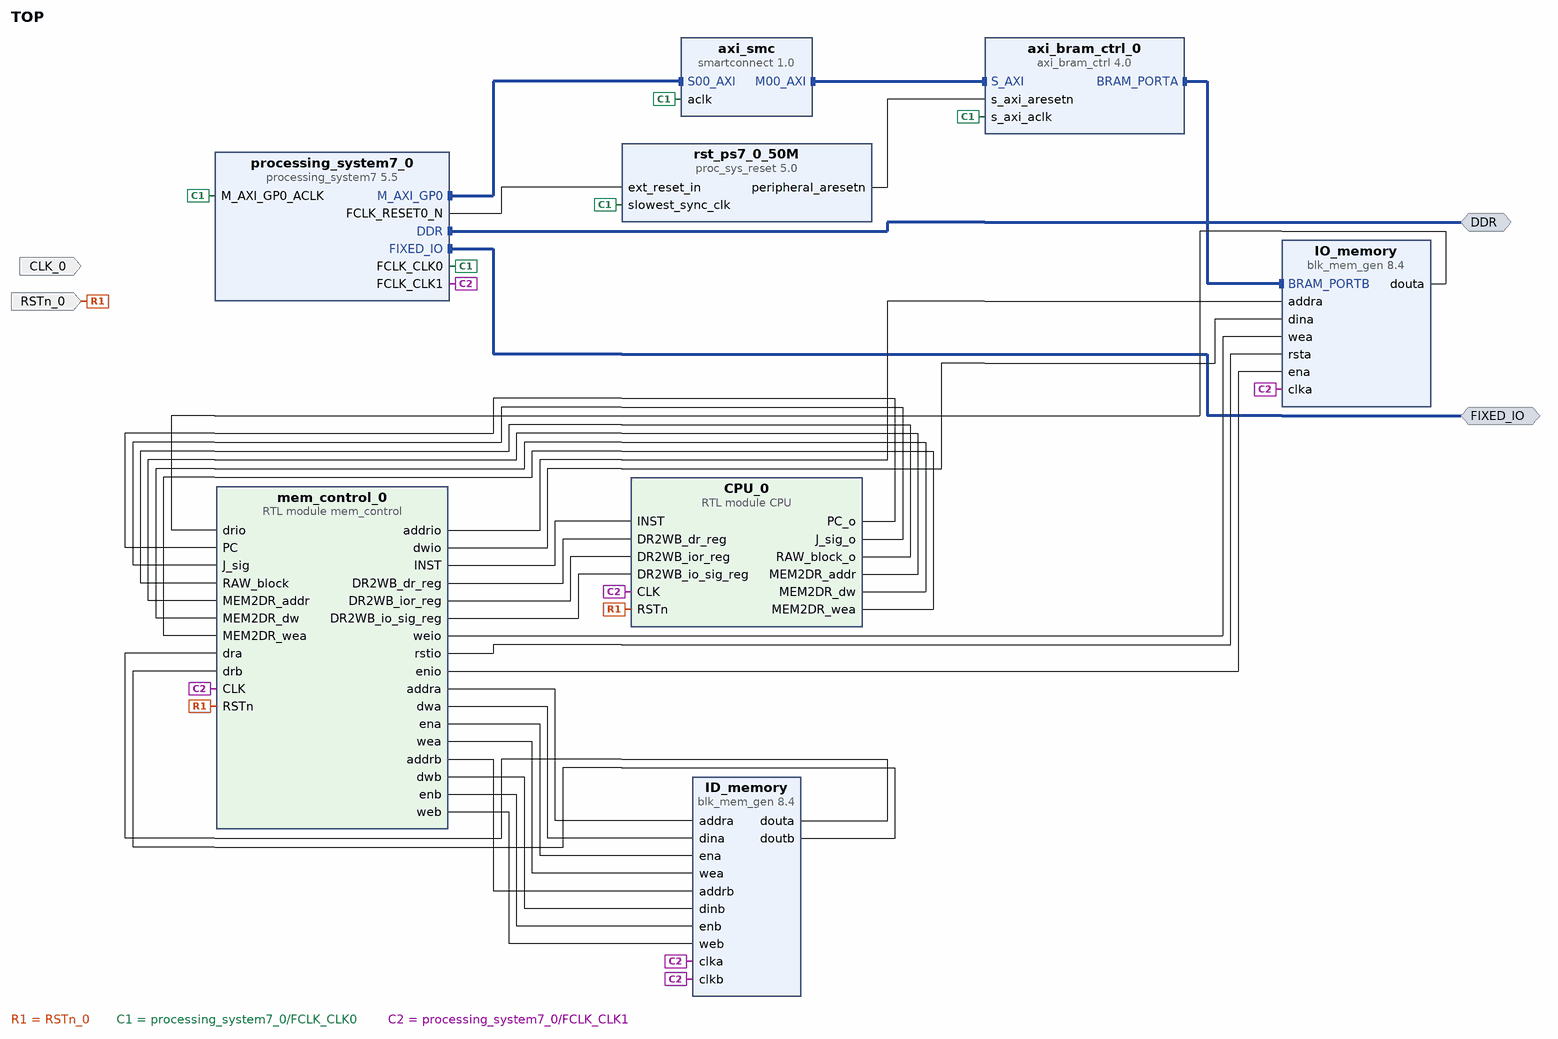
[diagram p0: block diagram of the top level]
# Vivado block design TOP, xc7z020clg400-2, Vivado 2017.4
create_bd_design TOP

create_bd_intf_port -mode Master -vlnv xilinx.com:interface:ddrx_rtl:1.0 DDR
create_bd_intf_port -mode Master -vlnv xilinx.com:display_processing_system7:fixedio_rtl:1.0 FIXED_IO
create_bd_port -dir I -type clk CLK_0
set_property -dict {CONFIG.FREQ_HZ 1000000} [get_bd_ports CLK_0]
create_bd_port -dir I -type rst RSTn_0

create_bd_cell -type ip -vlnv xilinx.com:ip:blk_mem_gen:8.4 IO_memory
set_property -dict [list \
  CONFIG.Memory_Type True_Dual_Port_RAM \
  CONFIG.Enable_B Use_ENB_Pin \
  CONFIG.Use_RSTB_Pin true \
  CONFIG.Port_B_Clock 100 \
  CONFIG.Port_B_Write_Rate 50 \
  CONFIG.Port_B_Enable_Rate 100 \
  CONFIG.EN_SAFETY_CKT false \
] [get_bd_cells IO_memory]
create_bd_cell -type ip -vlnv xilinx.com:ip:axi_bram_ctrl:4.0 axi_bram_ctrl_0
set_property -dict {CONFIG.SINGLE_PORT_BRAM 1} [get_bd_cells axi_bram_ctrl_0]
create_bd_cell -type ip -vlnv xilinx.com:ip:processing_system7:5.5 processing_system7_0
set_property -dict [list \
  CONFIG.PCW_FCLK_CLK1_BUF TRUE \
  CONFIG.PCW_SDIO_PERIPHERAL_FREQMHZ 100 \
  CONFIG.PCW_UART_PERIPHERAL_FREQMHZ 100 \
  CONFIG.PCW_FPGA1_PERIPHERAL_FREQMHZ 1 \
  CONFIG.PCW_EN_CLK1_PORT 1 \
  CONFIG.PCW_PRESET_BANK1_VOLTAGE {LVCMOS 1.8V} \
  CONFIG.PCW_UIPARAM_DDR_PARTNO {MT41J256M16 RE-125} \
  CONFIG.PCW_QSPI_PERIPHERAL_ENABLE 1 \
  CONFIG.PCW_QSPI_QSPI_IO {MIO 1 .. 6} \
  CONFIG.PCW_QSPI_GRP_SINGLE_SS_ENABLE 1 \
  CONFIG.PCW_QSPI_GRP_SINGLE_SS_IO {MIO 1 .. 6} \
  CONFIG.PCW_SINGLE_QSPI_DATA_MODE x4 \
  CONFIG.PCW_QSPI_GRP_FBCLK_ENABLE 1 \
  CONFIG.PCW_QSPI_GRP_FBCLK_IO {MIO 8} \
  CONFIG.PCW_ENET0_PERIPHERAL_ENABLE 1 \
  CONFIG.PCW_ENET0_ENET0_IO {MIO 16 .. 27} \
  CONFIG.PCW_ENET0_GRP_MDIO_ENABLE 1 \
  CONFIG.PCW_ENET0_GRP_MDIO_IO {MIO 52 .. 53} \
  CONFIG.PCW_ENET_RESET_ENABLE 1 \
  CONFIG.PCW_ENET_RESET_SELECT {Share reset pin} \
  CONFIG.PCW_ENET0_RESET_ENABLE 0 \
  CONFIG.PCW_SD0_PERIPHERAL_ENABLE 1 \
  CONFIG.PCW_SD0_SD0_IO {MIO 40 .. 45} \
  CONFIG.PCW_SD0_GRP_CD_ENABLE 1 \
  CONFIG.PCW_SD0_GRP_CD_IO {MIO 47} \
  CONFIG.PCW_SD0_GRP_WP_ENABLE 0 \
  CONFIG.PCW_UART1_PERIPHERAL_ENABLE 1 \
  CONFIG.PCW_UART1_UART1_IO {MIO 48 .. 49} \
  CONFIG.PCW_USB0_PERIPHERAL_ENABLE 1 \
  CONFIG.PCW_USB0_USB0_IO {MIO 28 .. 39} \
  CONFIG.PCW_USB_RESET_ENABLE 1 \
  CONFIG.PCW_USB_RESET_SELECT {Share reset pin} \
  CONFIG.PCW_USB0_RESET_ENABLE 1 \
  CONFIG.PCW_USB0_RESET_IO {MIO 46} \
  CONFIG.PCW_I2C_RESET_ENABLE 1 \
  CONFIG.PCW_GPIO_MIO_GPIO_ENABLE 1 \
  CONFIG.PCW_GPIO_MIO_GPIO_IO MIO \
  CONFIG.PCW_FPGA_FCLK1_ENABLE 1 \
] [get_bd_cells processing_system7_0]
# 204 more settings of processing_system7_0 are not shown: defaults, MIO pin electricals, DDR timing, and values the tool derives
create_bd_cell -type ip -vlnv xilinx.com:ip:proc_sys_reset:5.0 rst_ps7_0_50M
create_bd_cell -type ip -vlnv xilinx.com:ip:smartconnect:1.0 axi_smc
set_property -dict {CONFIG.NUM_SI 1} [get_bd_cells axi_smc]
create_bd_cell -type ip -vlnv xilinx.com:ip:blk_mem_gen:8.4 ID_memory
set_property -dict [list \
  CONFIG.Memory_Type True_Dual_Port_RAM \
  CONFIG.Enable_32bit_Address true \
  CONFIG.Write_Depth_A 65536 \
  CONFIG.Enable_B Use_ENB_Pin \
  CONFIG.Register_PortA_Output_of_Memory_Primitives false \
  CONFIG.Register_PortB_Output_of_Memory_Primitives false \
  CONFIG.Load_Init_File true \
  CONFIG.Coe_File d:/a.coe \
  CONFIG.Fill_Remaining_Memory_Locations false \
  CONFIG.Use_RSTA_Pin false \
  CONFIG.Use_RSTB_Pin false \
  CONFIG.Port_B_Clock 100 \
  CONFIG.Port_B_Write_Rate 50 \
  CONFIG.Port_B_Enable_Rate 100 \
  CONFIG.use_bram_block Stand_Alone \
] [get_bd_cells ID_memory]
create_bd_cell -type module -reference CPU CPU_0
create_bd_cell -type module -reference mem_control mem_control_0

# ---- connections ----

connect_bd_intf_net [get_bd_intf_pins axi_bram_ctrl_0/BRAM_PORTA] [get_bd_intf_pins IO_memory/BRAM_PORTB]
connect_bd_intf_net [get_bd_intf_pins processing_system7_0/M_AXI_GP0] [get_bd_intf_pins axi_smc/S00_AXI]
connect_bd_intf_net [get_bd_intf_pins axi_smc/M00_AXI] [get_bd_intf_pins axi_bram_ctrl_0/S_AXI]
connect_bd_intf_net [get_bd_intf_ports DDR] [get_bd_intf_pins processing_system7_0/DDR]
connect_bd_intf_net [get_bd_intf_ports FIXED_IO] [get_bd_intf_pins processing_system7_0/FIXED_IO]
connect_bd_net [get_bd_pins mem_control_0/INST] [get_bd_pins CPU_0/INST]
connect_bd_net [get_bd_pins CPU_0/PC_o] [get_bd_pins mem_control_0/PC]
connect_bd_net [get_bd_pins CPU_0/J_sig_o] [get_bd_pins mem_control_0/J_sig]
connect_bd_net [get_bd_pins CPU_0/RAW_block_o] [get_bd_pins mem_control_0/RAW_block]
connect_bd_net [get_bd_pins CPU_0/MEM2DR_addr] [get_bd_pins mem_control_0/MEM2DR_addr]
connect_bd_net [get_bd_pins CPU_0/MEM2DR_dw] [get_bd_pins mem_control_0/MEM2DR_dw]
connect_bd_net [get_bd_pins CPU_0/MEM2DR_wea] [get_bd_pins mem_control_0/MEM2DR_wea]
connect_bd_net [get_bd_pins mem_control_0/DR2WB_dr_reg] [get_bd_pins CPU_0/DR2WB_dr_reg]
connect_bd_net [get_bd_pins mem_control_0/DR2WB_ior_reg] [get_bd_pins CPU_0/DR2WB_ior_reg]
connect_bd_net [get_bd_pins mem_control_0/DR2WB_io_sig_reg] [get_bd_pins CPU_0/DR2WB_io_sig_reg]
connect_bd_net [get_bd_pins mem_control_0/addrio] [get_bd_pins IO_memory/addra]
connect_bd_net [get_bd_pins mem_control_0/dwio] [get_bd_pins IO_memory/dina]
connect_bd_net [get_bd_pins mem_control_0/weio] [get_bd_pins IO_memory/wea]
connect_bd_net [get_bd_pins mem_control_0/rstio] [get_bd_pins IO_memory/rsta]
connect_bd_net [get_bd_pins IO_memory/douta] [get_bd_pins mem_control_0/drio]
connect_bd_net [get_bd_pins mem_control_0/enio] [get_bd_pins IO_memory/ena]
connect_bd_net [get_bd_pins processing_system7_0/FCLK_RESET0_N] [get_bd_pins rst_ps7_0_50M/ext_reset_in]
connect_bd_net -net RSTn_0_1 [get_bd_ports RSTn_0] [get_bd_pins CPU_0/RSTn] [get_bd_pins mem_control_0/RSTn]
connect_bd_net [get_bd_pins processing_system7_0/FCLK_CLK0] \
  [get_bd_pins axi_bram_ctrl_0/s_axi_aclk] [get_bd_pins axi_smc/aclk] [get_bd_pins rst_ps7_0_50M/slowest_sync_clk] \
  [get_bd_pins processing_system7_0/M_AXI_GP0_ACLK]
connect_bd_net [get_bd_pins rst_ps7_0_50M/peripheral_aresetn] [get_bd_pins axi_bram_ctrl_0/s_axi_aresetn]
connect_bd_net [get_bd_pins mem_control_0/addra] [get_bd_pins ID_memory/addra]
connect_bd_net [get_bd_pins mem_control_0/dwa] [get_bd_pins ID_memory/dina]
connect_bd_net -net blk_mem_gen_0_douta [get_bd_pins ID_memory/douta] [get_bd_pins mem_control_0/dra]
connect_bd_net [get_bd_pins mem_control_0/ena] [get_bd_pins ID_memory/ena]
connect_bd_net [get_bd_pins mem_control_0/wea] [get_bd_pins ID_memory/wea]
connect_bd_net [get_bd_pins mem_control_0/addrb] [get_bd_pins ID_memory/addrb]
connect_bd_net [get_bd_pins mem_control_0/dwb] [get_bd_pins ID_memory/dinb]
connect_bd_net -net blk_mem_gen_0_doutb [get_bd_pins ID_memory/doutb] [get_bd_pins mem_control_0/drb]
connect_bd_net [get_bd_pins mem_control_0/enb] [get_bd_pins ID_memory/enb]
connect_bd_net [get_bd_pins mem_control_0/web] [get_bd_pins ID_memory/web]
connect_bd_net [get_bd_pins processing_system7_0/FCLK_CLK1] \
  [get_bd_pins IO_memory/clka] [get_bd_pins ID_memory/clkb] [get_bd_pins ID_memory/clka] [get_bd_pins CPU_0/CLK] \
  [get_bd_pins mem_control_0/CLK]

# ---- address map ----
assign_bd_address -offset 0x40000000 -range 8K -target_address_space [get_bd_addr_spaces processing_system7_0/Data] [get_bd_addr_segs axi_bram_ctrl_0/S_AXI/Mem0]

validate_bd_design
save_bd_design
